# Altium schematic sheet Power.SchDoc: Power
size 431 x 279 mm; Author: Alberto Marrone, Christian Schmitz, Leo Walter; DrawnBy: Alberto Marrone, Christian Schmitz, Leo Walter; Engineer: Alberto Marrone, Christian Schmitz, Leo Walter; Revision: V1.0; SheetNumber: 2; Project: PCB Design Final Project
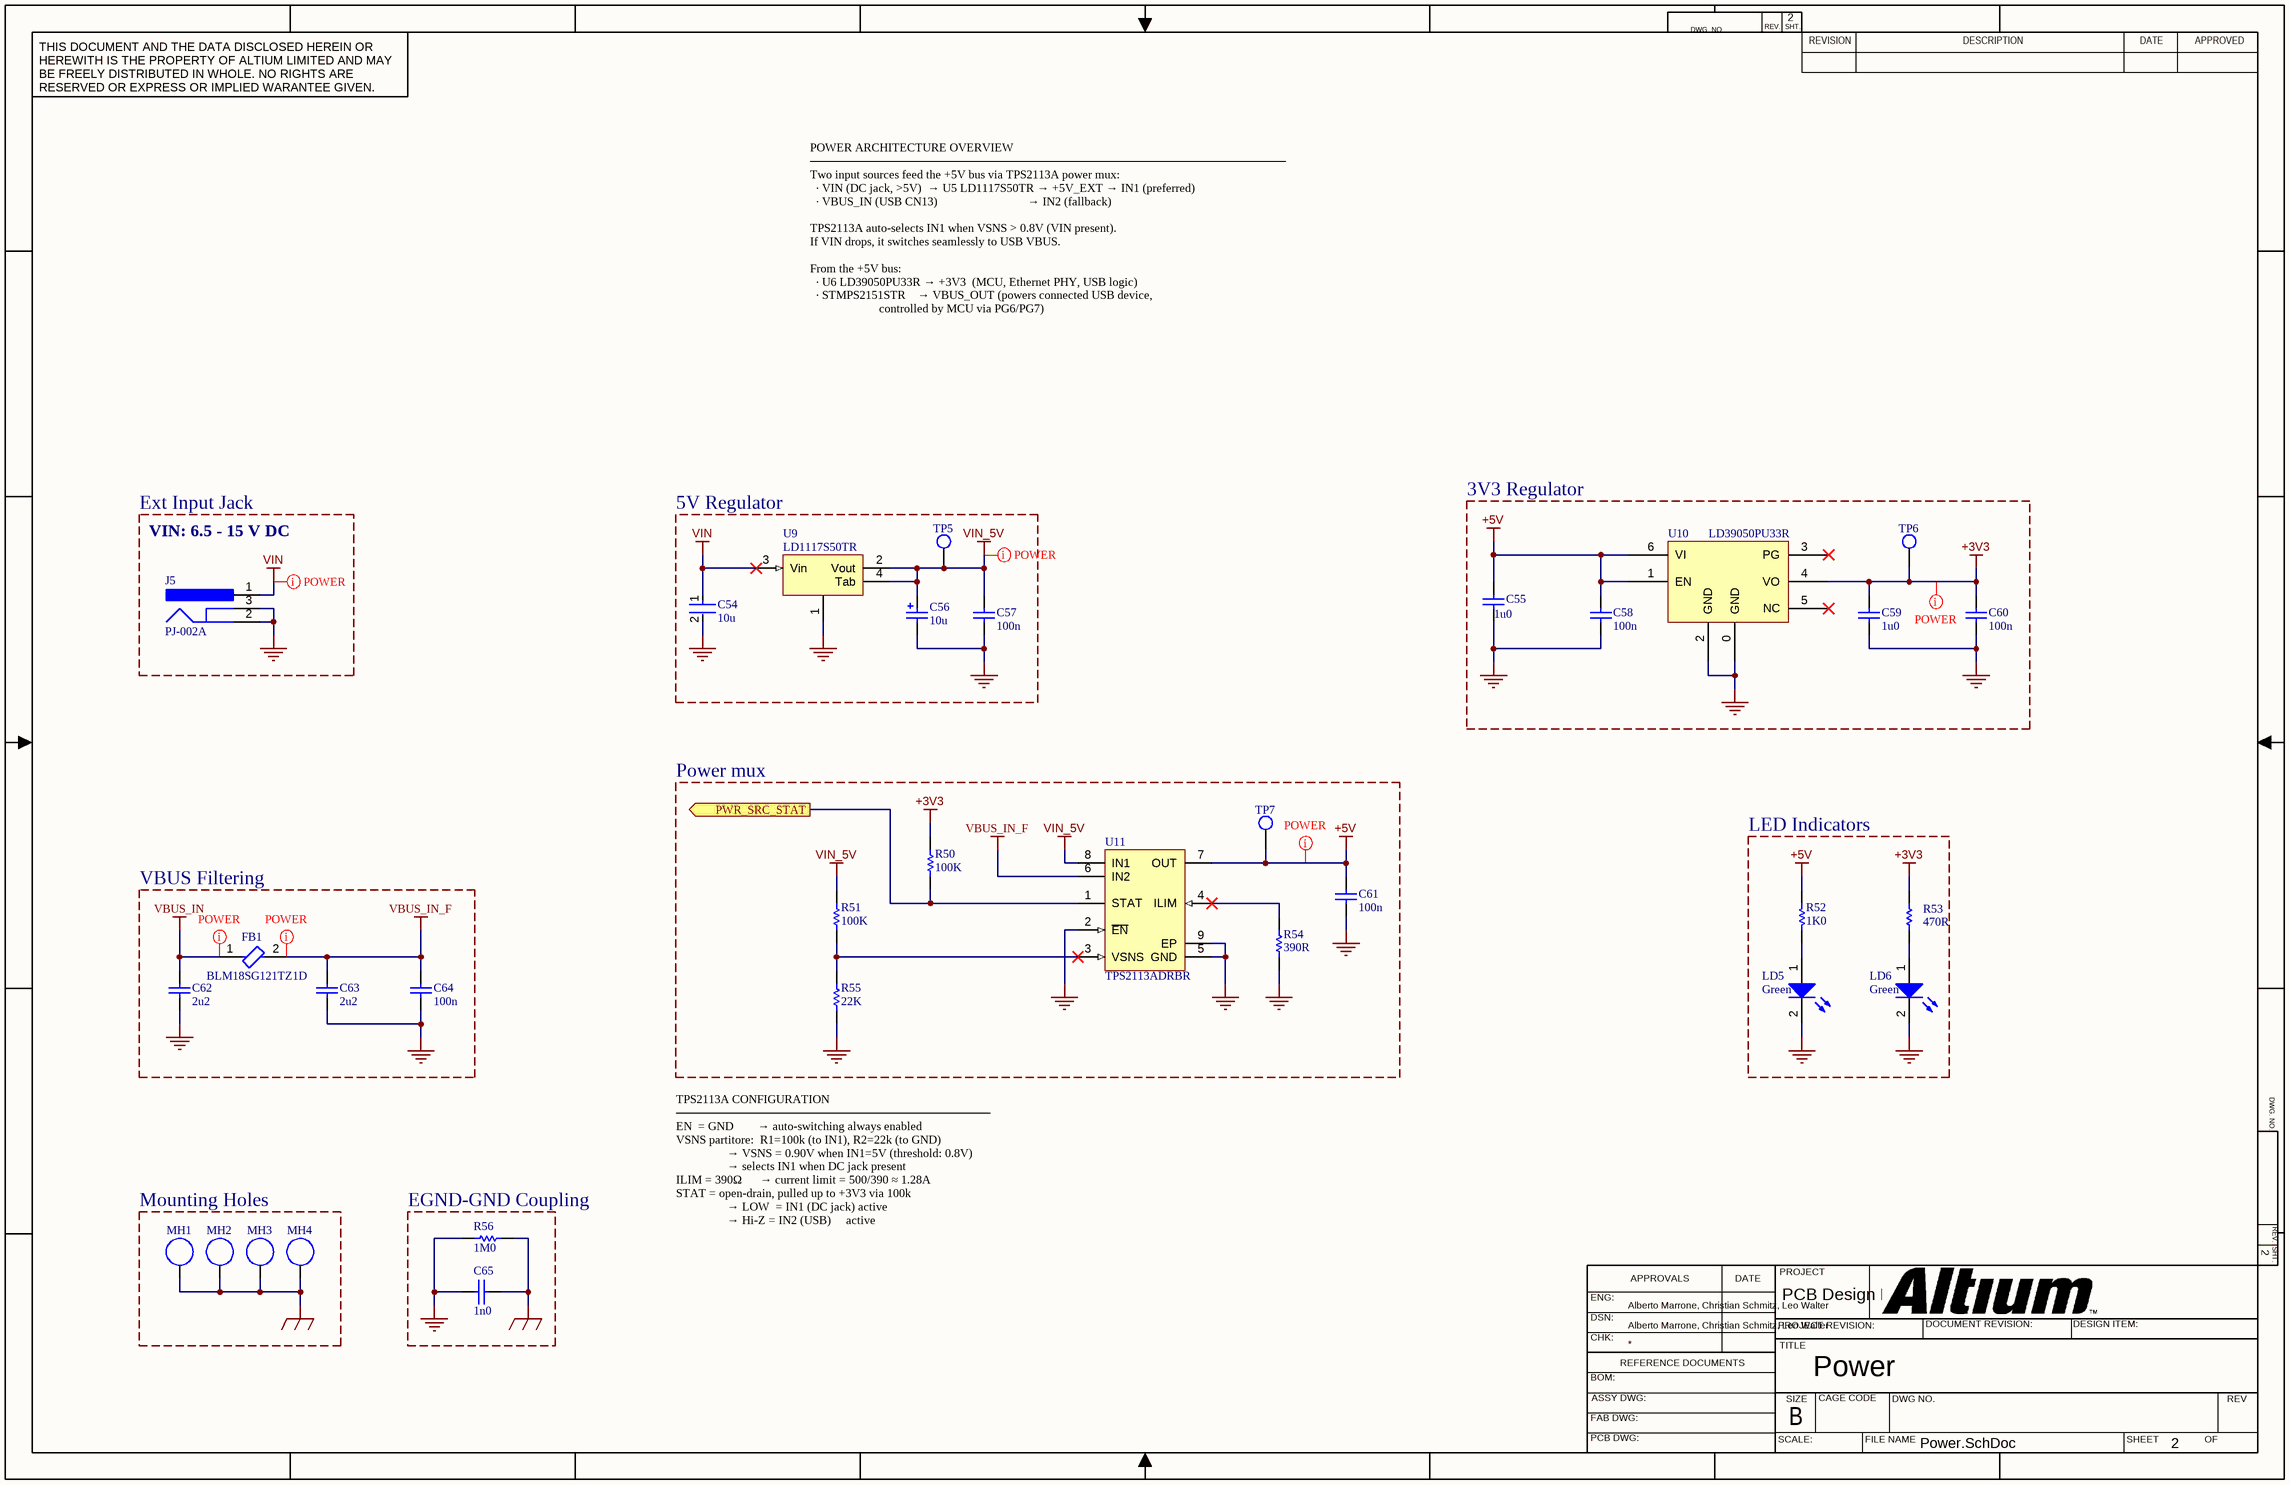
[diagram p0: Power.SchDoc]

## Parts
C54  10u  [FP-CL32-IPC_C]
C55  1u0  [0603C]
C56  10u  [TAN-B]
C57  100n  [0603C]
C58  100n  [0603C]
C59  1u0  [0603C]
C60  100n  [0603C]
C61  100n  [0603C]
C62  2u2  [TAN-A]
C63  2u2  [TAN-A]
C64  100n  [0603C]
C65  1n0  [0603C]
FB1  BLM18SG121TZ1D  [FP-BLM18-0_15-t0_5-d1_2-MFG]
J5  PJ-002A  [CUI-PJ-002A_V]
LD5  Green  [0603D-G]
LD6  Green  [0603D-G]
MH1  Mounting Hole  [MountingHole_3.5mm]  (value not drawn)  (no BOM)
MH2  Mounting Hole  [MountingHole_3.5mm]  (value not drawn)  (no BOM)
MH3  Mounting Hole  [MountingHole_3.5mm]  (value not drawn)  (no BOM)
MH4  Mounting Hole  [MountingHole_3.5mm]  (value not drawn)  (no BOM)
R50  100K  [0603R]
R51  100K  [0603R]
R52  1K0  [0603R]
R53  470R  [0603R]
R54  390R  [0603R]
R55  22K  [0603R]
R56  1M0  [0603R]
TP5  Test Point  [TP_SMD_0.8]  (value not drawn)  (no BOM)
TP6  Test Point  [TP_SMD_0.8]  (value not drawn)  (no BOM)
TP7  Test Point  [TP_SMD_0.8]  (value not drawn)  (no BOM)
U9  LD1117S50TR  [SOT-223]
U10  LD39050PU33R  [DFN6_0R95_3x3_TP]
U11  TPS2113ADRBR  [DRB0008B_V]

## Blocks framed on the sheet
Ext Input Jack: J5
5V Regulator: C54 C56 C57 TP5 U9
3V3 Regulator: C55 C58-C60 TP6 U10
Power mux: C61 R50 R51 R54 R55 TP7 U11
LED Indicators: LD5 LD6 R52 R53
VBUS Filtering: C62-C64 FB1
Mounting Holes: MH1-MH4
EGND-GND Coupling: C65 R56

## Ports
PWR_SRC_STAT (out)

## Nets
+3V3: C59.1 C60.2 R50.1 R53.2 TP6.1 U10.4(VO)
+5V: C55.1 C58.2 C61.2 R52.2 TP7.1 U10.1(EN) U10.6(VI) U11.7(OUT)
EGND: C65.2 MH1.1 MH2.1 MH3.1 MH4.1 R56.2
GND: C54.2 C55.2 C56.2 C57.1 C58.1 C59.2 C60.1 C61.1 C62.2 C63.2 C64.1 C65.1 J5.2 J5.3 LD5.2(K) LD6.2(K) R54.2 R55.2 R56.1 U9.1 U10.0(GND) U10.2(GND) U11.2(~{EN}) U11.5(GND) U11.9(EP)
VBUS_IN: C62.1 FB1.1
VBUS_IN_F: C63.1 C64.2 FB1.2 U11.6(IN2)
VIN: C54.1 J5.1 U9.3(Vin)
VIN_5V: C56.1 C57.2 R51.1 TP5.1 U9.2(Vout) U9.4(Tab) U11.8(IN1)
PWR_SRC_STAT: R50.2 U11.1(STAT) ; port PWR_SRC_STAT
NetLD5_1: LD5.1(A) R52.1
NetLD6_1: LD6.1(A) R53.1
NetR51_2: R51.2 R55.1 U11.3(VSNS)
NetR54_1: R54.1 U11.4(ILIM)

Not connected (* = marked no-connect by the designer): U10 3(PG)* 5(NC)*

## Layout directives
net class POWER: +3V3, +5V, VBUS_IN, VBUS_IN_F, VIN, VIN_5V

## Notes on the sheet
- POWER ARCHITECTURE OVERVIEW
  ────────────────────────────────────────────────────────
  Two input sources feed the +5V bus via TPS2113A power mux:
  · VIN (DC jack, >5V)  → U5 LD1117S50TR → +5V_EXT → IN1 (preferred)
  · VBUS_IN (USB CN13)                              → IN2 (fallback)
  TPS2113A auto-selects IN1 when VSNS > 0.8V (VIN present).
  If VIN drops, it switches seamlessly to USB VBUS.
  From the +5V bus:
  · U6 LD39050PU33R → +3V3  (MCU, Ethernet PHY, USB logic)
  · STMPS2151STR    → VBUS_OUT (powers connected USB device,
  controlled by MCU via PG6/PG7)
- VIN: 6.5 - 15 V DC
- TPS2113A CONFIGURATION
  ─────────────────────────────────────
  EN  = GND        → auto-switching always enabled
  VSNS partitore:  R1=100k (to IN1), R2=22k (to GND)
  → VSNS = 0.90V when IN1=5V (threshold: 0.8V)
  → selects IN1 when DC jack present
  ILIM = 390Ω      → current limit = 500/390 ≈ 1.28A
  STAT = open-drain, pulled up to +3V3 via 100k
  → LOW  = IN1 (DC jack) active
  → Hi-Z = IN2 (USB)     active
- DWG. NO.
- REV.
- SHT.
- THIS DOCUMENT AND THE DATA DISCLOSED HEREIN OR HEREWITH IS THE PROPERTY OF ALTIUM LIMITED AND MAY BE FREELY DISTRIBUTED IN WHOLE. NO RIGHTS ARE RESERVED OR EXPRESS OR IMPLIED WARANTEE GIVEN.
- REVISION
- DESCRIPTION
- DATE
- APPROVED
- ENG:
- APPROVALS
- PROJECT
- DSN:
- CHK:
- REFERENCE DOCUMENTS
- PROJECT REVISION:
- TITLE
- DOCUMENT REVISION:
- DESIGN ITEM:
- BOM:
- FAB DWG:
- PCB DWG:
- ASSY DWG:
- SCALE:
- SIZE
- B
- CAGE CODE
- FILE NAME
- DWG NO.
- SHEET
- OF
- REV

## Library data of the parts
C54 = CMP-2000-06110-2: Cap Ceramic 10uF 50V X7R ±10% SMD 1210 +125°C Embossed T/R; Material: Ceramic; Min Operating Temperature: -55°C; Depth: 2.5mm; Radiation Hardening: No; Value: 10u; Packaging: Tape and Reel; Dielectric: X7R; Case Code (Metric): 3225; Height: 2.5mm; Thickness: 0.106inch; Voltage Rating (DC): 50V; Voltage Rating: 50V; Width: 0.098inch; Case Code (Imperial): 1210; Length: 3.2mm; Tolerance: 10%; Lead Free: Lead Free; Package Quantity: 1; Voltage: 50V; Mount: Surface Mount; Case/Package: 1210; Max Operating Temperature: 125°C
C55 C59 = CAP SMD 0603  X5R 1µF 25V 10%: Capacitor; Voltage Rating: 25V; Tolerance: 10%; Dielectric: X5R; Manufacturer: *; Manufacturer P/N: *; Order code Farnell: 1288202RL; Value: 1u0; Power: *; Temperature  Factor: *; Temperature Max: +125°C; Temperature Min: -55°C; STS Code: *
C56 = Cap Pol1: Tantalum Capacitor; Voltage Rating: 25V; Published: 8-Jun-2000; Revision: July-2002: Re-released for DXP Platform.; Publisher: Altium Limited; Value: 10u
C57 C58 C60 C61 C64 = Cap: Capacitor; Dielectric: X7R; Published: 8-Jun-2000; Revision: July-2002: Re-released for DXP Platform.; Publisher: Altium Limited; Value: 100n
C62 C63 = Cap_2.2uF_X7R_10%_0805: Capacitor,2.2uF,16V, X7R,10%,0805,YAGEO; Manuf_Part_1: CC0805KKX7R7BB225; Revision: July-2002: Re-released for DXP Platform.; Value: 2u2; Order: CC0805KKX7R7BB225; Manuf_1: YAGEO; Dielectric: X7R
C65 = CAP: Capacitor; Voltage: 50V; Dielectric: C0G; Value: 1n0
FB1 = CMP-06046-001168-2: Chip Ferrite Bead, 0603, 120Ω @ 100MHz, 25%, 0.025Ω, 3A; Number of Lines: 1; DC Resistance (DCR): 25mR; Max Current Rating: 3A; Min Operating Temperature: -55°C; Max Operating Temperature: 125°C; Ratings: AEC-Q200; RoHS Compliant: Yes; Case Code (Metric): 1608; Mount: Surface Mount; Case Code (Imperial): 0603; Packaging: Cut Tape; Case/Package: 0603
J5 = CMP-2000-06895-2: Through Hole Right Angle DC Power Jack, 2.5 A, 2 mm Center Pin, 3 Position, -25 to 85 degC, RoHS, Bulk; Manufacturer: CUIInc.; Brand: CUI; Inside Contact Diameter: 2mm; Voltage Rating: 24V; Outside Contact Diameter: 6.5mm; Current Rating: 2.5A; Insulation Resistance: 50MOhms; Contact Gender: Male; Connector Type: DCPowerJack; Datasheet Version: Rev. 1.03, 04/2016; Housing Material: PolybutyleneTerephthalate(PBT); Operating Temperature Range: -25Cto+85C; Termination Style: ThroughHole; Product Category: DCPowerConnectors; Mounting Technology: ThroughHole; Mounting Style: ThroughHole; Factory Pack Quantity: 500; Contact Plating: Nickel; Package Reference: PJ-002A; Mounting Angle: Right; Package Description: 3-Pin Through Hole Device, Body 14.4 x 9 mm, Height 11 mm; Flammability Rating: UL94V-0; Manufacturer URL: http://www.cui.com/; Product: Jacks; Contact Material: Copper; Datasheet URL: http://www.cui.com/product/resource/pj-002a.pdf; RoHS: True
LD5 LD6 = LED2: Typical RED, GREEN, YELLOW, AMBER GaAs LED; Published: 8-Jun-2000; Revision: July-2002: Re-released for DXP Platform.; Publisher: Altium Limited
MH1-MH4 = MountingHole
R50 R51 R54 R55 = res1: Resistor; Published: 8-Jun-2000; Revision: July-2002: Re-released for DXP Platform.; Publisher: Altium Limited
  R50 R51: Value: 100K
  R54: Value: 390R
  R55: Value: 22K
R52 = Res1: Resistor; Published: 8-Jun-2000; Revision: July-2002: Re-released for DXP Platform.; Publisher: Altium Limited; Value: 1K0
R53 = Resistor_ST: Resistor 0402 / 0603 / 0805; Value: 470R
R56 = Res1: Resistor; Ordered by: Subcon; Published: 8-Jun-2000; Revision: July-2002: Re-released for DXP Platform.; Publisher: Altium Limited; Value: 1M0
TP5-TP7 = Test_Point
U9 = LD1117
U10 = LD39050P
U11 = CMP-0339-00015-2: Dual In / Single Out Autoswitching Power Mux, 2.8 to 5.5 V, -40 to 85 degC, 9-pin SON (DRB), Green (RoHS & no Sb/Br); Manufacturer: Texas Instruments; IN1, IN2 Input Voltage(Min)(V): 2.8; SubFamily: Power Multiplexer (MUX); IN1 rDS(on)(Typ)(mOhm): 84; IN2 rDS(on)(Typ)(Ohms): 0.084; Number of Inputs: 2; IN1, IN2 Input Voltage(Max)(V): 5.5; IN2 Output Current(Max)(A): 1.25; PackageVersion: revK, Jun-2012; PackageDescription: 8-Pin Plastic Small Outline No-Lead, 3 x 3 x 1 mm Body, 0.65 mm Pitch, Exposed Pad; ComponentLink1Description: Datasheet; ComponentLink1URL: http://www.ti.com/general/docs/lit/getliterature.tsp?genericPartNumber=TPS2113A&fileType=pdf; DatasheetVersion: SBVS045C; Eco-Plan: Green (RoHS & no Sb/Br); PartNumber: TPS2113ADRBR; Mounting Technology: Surface Mount; PackageReference: DRB0008B; IN1 Output Current(Max)(A): 1.25